# EAGLE design Board (EAGLE 9.6.2)
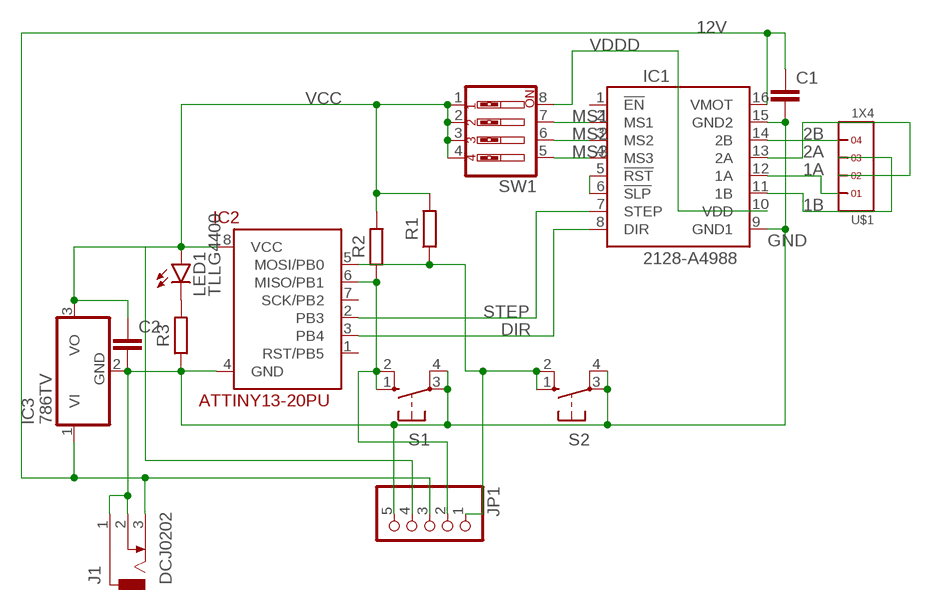
[diagram p0: schematic, sheet 1]

## Parts
C1  C2.5/6  [C2.5-6]
C2  C2.5/6  [C2.5-6]
IC1  2128-A4988  [A4988]
IC2  ATTINY13-20PU  [DIL08]
IC3  786TV  [TO220V]
J1  DCJ0202  [DCJ0202]
JP1  PINHD-1X5  [1X05]
LED1  TLLG4400  [LED3MM]
R1  R_AXIAL-7.2MM-PITCH  [RESAD724W46L381D178B]
R2  R_AXIAL-7.2MM-PITCH  [RESAD724W46L381D178B]
R3  R_AXIAL-7.2MM-PITCH  [RESAD724W46L381D178B]
S1  10-XX  [B3F-10XX]
S2  10-XX  [B3F-10XX]
SW1  SW_DIP-4  [EDG-04]
U$1  1X4  [1X4]

## Nets
1A: IC1.12(1A) U$1.1
1B: IC1.11(1B) U$1.3
2A: IC1.13(2A) U$1.2
2B: IC1.14(2B) U$1.4
12V: C1.1 IC1.16(VMOT) IC3.1(VI) J1.3 JP1.3
DIR: IC1.8(DIR) IC2.3(PB4)
GND: C1.2 C2.2 IC1.9(GND1) IC1.15(GND2) IC2.4(GND) IC3.2(GND) J1.1 J1.2 JP1.5 R3.1 S1.3(P) S1.4(P1) S2.3(P) S2.4(P1)
MS1: IC1.2(MS1) SW1.7
MS2: IC1.3(MS2) SW1.6
MS3: IC1.4(MS3) SW1.5
N$7: LED1.K(C) R3.2
N$8: IC2.5(MOSI/PB0) JP1.1 R1.1 S2.1(S) S2.2(S1)
N$10: IC1.5(!RST) IC1.6(!SLP)
PB1: IC2.6(MISO/PB1) JP1.2 R2.1 S1.1(S) S1.2(S1)
STEP: IC1.7(STEP) IC2.2(PB3)
VCC: C2.1 IC2.8(VCC) IC3.3(VO) JP1.4 LED1.A R1.2 R2.2 SW1.1 SW1.2 SW1.3 SW1.4
VDDD: IC1.10(VDD) SW1.8
Unconnected: IC1.1(!EN) IC2.1(RST/PB5) IC2.7(SCK/PB2)

## Library data of the parts
C1 C2 = capacitor-wima:C: CAPACITOR naming: grid - package width
IC1 = pololu-stepper-driver:2128-A4988: A4988 Stepper Motor Driver Carrier; Black Edition #2128 A4988 Stepper Motor Driver Carrier; Black Edition <https://www.pololu.com/product/2128> in Japan, Suzaku Lab. Ltd. <https://suzakugiken.jp/> #2128 A4988ステッピングモータドライバ Black Edition <https://szc.jp/po2128>
IC2 = attiny13:ATTINY13-20*
IC3 = linear:78*: Positive VOLTAGE REGULATOR Source: http://cache.national.com/ds/LM/LM78L05.pdf http://www.fairchildsemi.com/ds/LM/LM7805.pdf
J1 = con-jack:DCJ0202: DC POWER JACK Source: DCJ0202.pdf; OC_FARNELL: unknown; OC_NEWARK: unknown
JP1 = pinhead:PINHD-1X5: PIN HEADER
LED1 = led:TLLG4400: Low Current (2mA) LED 3 mm Tinted Diffused Package color GREEN Source: Data sheet <http://www.farnell.com/datasheets/391098.pdf>; MF: VISHAY SEMICONDUCTOR; OC_FARNELL: 1612435
R1-R3 = Resistor:R: Resistor Fixed - Generic; CATEGORY: Resistor; SUB-CATEGORY: Fixed
S1 S2 = switch-omron:10-XX: OMRON SWITCH; MPN: B3F-1000; OC_FARNELL: 176432; OC_NEWARK: 36M3542
SW1 = special:SW_DIP-4: DIP SWITCH
U$1 = headers(2mm):1X4

## Board
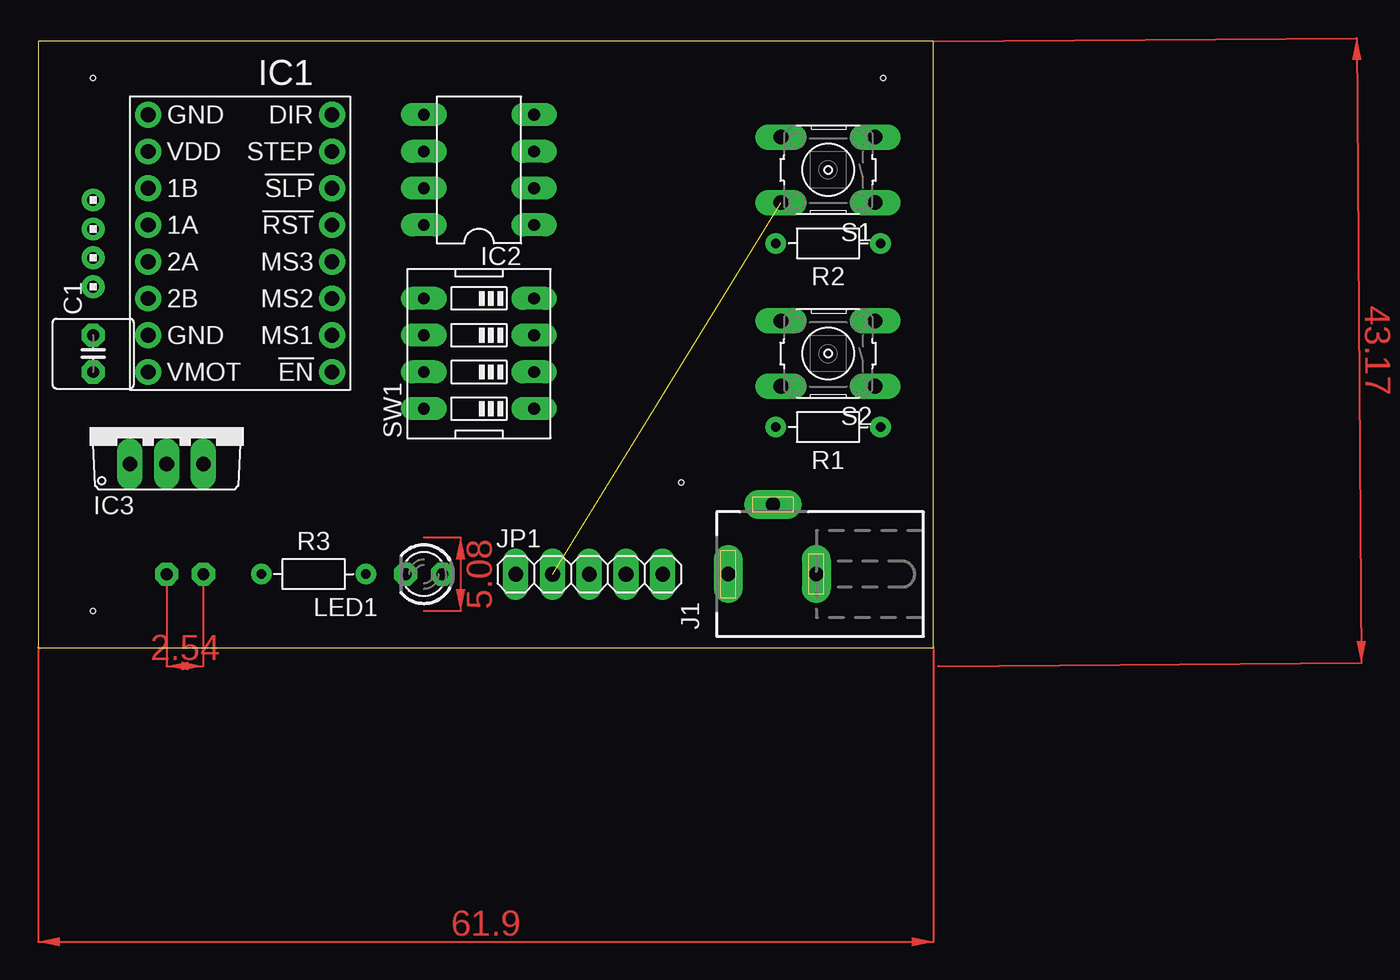
[diagram p1: board, top side]
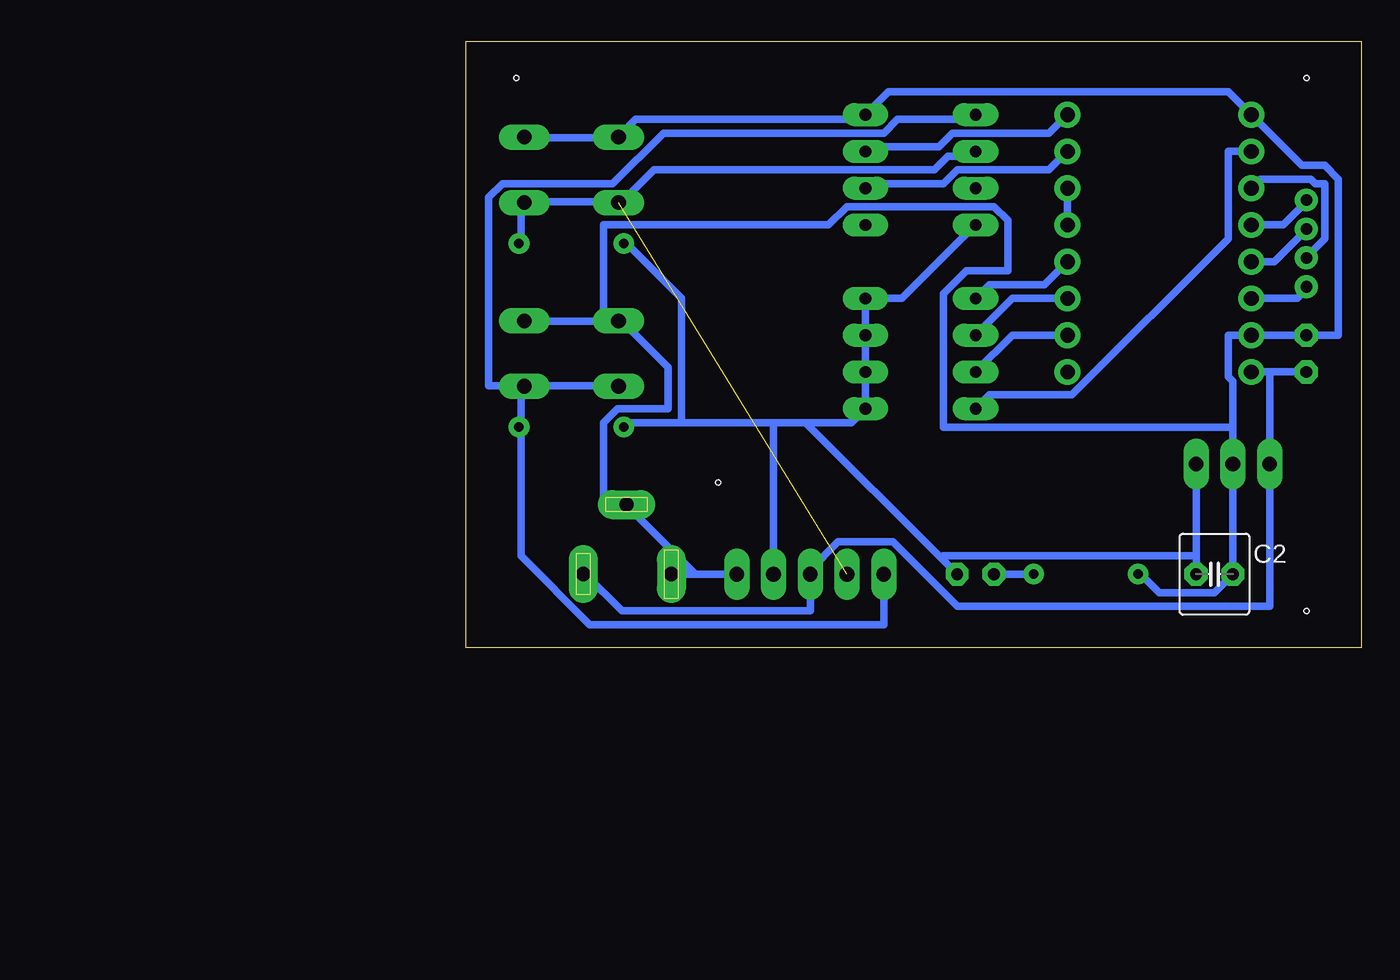
[diagram p2: board, bottom side, seen from below]

Size 61.9 x 41.9 mm. Coordinates in mm from the lower left corner, seen from the top.
Outline: 0,0 61.9,0 61.9,41.9 0,41.9 0,0
Copper layers (1*16): Top 0.035mm / dielectric 1.5mm / Bottom 0.035mm
Design rules "default *": minimum track width 20mil, minimum drill 0.35mm, track to track 15mil, track to pad 6mil, pad to pad 6mil, via to via 6mil, smd to smd 6mil, copper to edge 40mil, drill to drill 6mil, minimum pad ring 15mil, minimum via ring 8mil, stop-mask expansion 4mil, vias tented up to drill 0mil, thermal gap 10mil
Holes 0.35 mm at 44.45,11.43 3.81,2.54 3.81,39.37 58.42,39.37

### Footprints (pad centres in the part's own frame; a part is rotated, then mirrored left to right if it is on the bottom)
C2.5-6 = drill 0.813 pad 1.6 octagon: 1 -1.27,0; 2 1.27,0
A4988 = drill 1.016: 1 -6.35,8.89; 2 -6.35,6.35; 3 -6.35,3.81; 4 -6.35,1.27; 5 -6.35,-1.27; 6 -6.35,-3.81; 7 -6.35,-6.35; 8 -6.35,-8.89; 9 6.35,-8.89; 10 6.35,-6.35; 11 6.35,-3.81; 12 6.35,-1.27; 13 6.35,1.27; 14 6.35,3.81; 15 6.35,6.35; 16 6.35,8.89
DIL08 = drill 0.813 long: 1 -3.81,-3.81; 2 -1.27,-3.81; 3 1.27,-3.81; 4 3.81,-3.81; 5 3.81,3.81; 6 1.27,3.81; 7 -1.27,3.81; 8 -3.81,3.81
TO220V = drill 1.016 long: 1 -2.54,-2.54; 2 0,-2.54; 3 2.54,-2.54
DCJ0202 = drill 1 pad 2 long: 1 0,3.1; 2 4.8,0; 3 0,-3
1X05 = drill 1.016 long: 1 -5.08,0; 2 -2.54,0; 3 0,0; 4 2.54,0; 5 5.08,0
LED3MM = drill 0.813 octagon: A -1.27,0; K 1.27,0
RESAD724W46L381D178B = drill 0.66 pad 1.26: 1 -3.62,0; 2 3.62,0
B3F-10XX = drill 1.016 long: 1 -3.251,2.261; 2 3.251,2.261; 3 -3.251,-2.261; 4 3.251,-2.261
EDG-04 = drill 0.813 long: 1 -3.81,-3.81; 2 -1.27,-3.81; 3 1.27,-3.81; 4 3.81,-3.81; 5 3.81,3.81; 6 1.27,3.81; 7 -1.27,3.81; 8 -3.81,3.81
1X4 = drill 0.8 pad 1.422: 1 -3,0; 2 -1,0; 3 1,0; 4 3,0

### Placement (x,y rotation side)
C1  3.81,20.32 90 top
C2  10.16,5.08 0 bottom
IC1  13.97,27.94 180 top
IC2  30.48,33.02 90 top
IC3  8.89,15.24 0 top
J1  50.8,5.08 90 top
JP1  38.1,5.08 0 top
LED1  26.67,5.08 180 top
R1  54.61,15.24 180 top
R2  54.61,27.94 180 top
R3  19.05,5.08 0 top
S1  54.61,33.02 180 top
S2  54.61,20.32 180 top
SW1  30.48,20.32 90 top
U$1  3.81,27.94 270 top

### Tracks (layer width: path | path; a pad name or v marks a point on that pad's centre or on a via)
1A
  Bottom 0.508: IC1.12 5.4,29.21 3.81,30.8 U$1.1
1B
  Bottom 0.508: IC1.11 6.99,32.38 3.49,32.38 3.18,32.07 2.54,32.07 2.54,28.26 3.81,26.99 U$1.3
2A
  Bottom 0.508: IC1.13 6.03,26.67 3.81,28.89 U$1.2
2B
  Bottom 0.508: IC1.14 4.45,24.13 3.81,24.77 U$1.4
12V
  Bottom 0.508: IC1.16 6.35,19.05 | 6.35,19.05 C1.1 | 6.35,19.05 IC3.1 6.35,2.86 27.94,2.86 32.38,7.3 36.2,7.3 38.1,5.4 JP1.3 38.1,2.54 51.12,2.54 53.66,5.08 J1.3
DIR
  Bottom 0.508: IC2.3 33.97,34.61 29.21,34.61 28.26,35.56 21.59,35.56 IC1.8
GND
  Bottom 0.508: 52.39,22.54 57.78,22.54 S2.3 | 52.39,22.54 51.43,22.54 S2.4 | J1.1 46.04,5.08 | 46.04,5.08 JP1.5 | 46.04,5.08 50.8,9.84 J1.2 50.8,10.16 52.39,10.16 52.39,15.56 51.43,16.51 47.94,16.51 47.94,19.37 51.12,22.54 S2.4 | S1.3 57.78,35.24 51.43,35.24 S1.4 51.12,35.56 50.16,36.51 34.61,36.51 IC2.4 32.7,38.42 9.21,38.42 IC1.9 4.13,33.34 2.54,33.34 1.59,32.38 1.59,21.59 C1.2 IC1.15 9.21,21.59 9.21,18.73 8.89,18.41 8.89,15.24 | R3.1 15.24,5.08 13.97,3.81 10.16,3.81 C2.2 IC3.2 8.89,15.24 | 52.39,22.54 52.39,29.21 36.83,29.21 35.56,30.48 25.4,30.48 24.45,29.53 24.45,26.04 27.3,26.04 28.89,24.45 28.89,15.24 8.89,15.24 | 52.39,22.54 S2.4
MS1
  Bottom 0.508: SW1.7 24.13,21.59 IC1.2
MS2
  Bottom 0.508: SW1.6 24.13,24.13 IC1.3
MS3
  Bottom 0.508: SW1.5 25.72,25.08 21.91,25.08 IC1.4
N$7
  Bottom 0.508: LED1.K R3.2
N$8
  Bottom 0.508: 58.1,15.24 58.1,17.78 S2.1 | IC2.5 26.99,36.51 32.07,36.51 33.02,35.56 48.26,35.56 51.75,32.07 59.37,32.07 60.32,31.11 60.32,18.1 58.1,18.1 S2.1 | JP1.1 33.02,1.59 53.34,1.59 58.1,6.35 58.1,15.24 | 58.1,15.24 R1.1 | S2.2 51.43,18.1 57.78,18.1 S2.1
N$10
  Bottom 0.508: IC1.6 IC1.5
PB1  (1 unrouted)
  Bottom 0.508: R2.1 58.1,27.94 58.1,30.48 S1.1 57.78,30.8 51.43,30.8 S1.2 51.12,30.8 48.89,33.02 29.53,33.02 28.57,33.97 26.99,33.97 IC2.6
STEP
  Bottom 0.508: IC2.2 33.97,32.07 28.89,32.07 27.94,33.02 21.59,33.02 IC1.7
VCC
  Bottom 0.508: IC2.8 31.75,24.13 SW1.4 SW1.3 SW1.2 SW1.1 35.24,15.56 38.42,15.56 | IC3.3 11.43,6.35 | 11.43,6.35 C2.1 | 38.42,15.56 40.64,15.56 | 40.64,15.56 46.99,15.56 | 46.99,15.56 50.48,15.56 50.8,15.24 R1.2 | 46.99,15.56 46.99,24.13 50.8,27.94 R2.2 | 38.42,15.56 29.05,6.19 | 29.05,6.19 LED1.A | 40.64,15.56 JP1.4 | 11.43,6.35 28.89,6.35 29.05,6.19
VDDD
  Bottom 0.508: SW1.8 25.72,17.46 20,17.46 9.21,28.26 9.21,34.29 IC1.10
(copper drawn outside any net)
  shapes: Top area x4